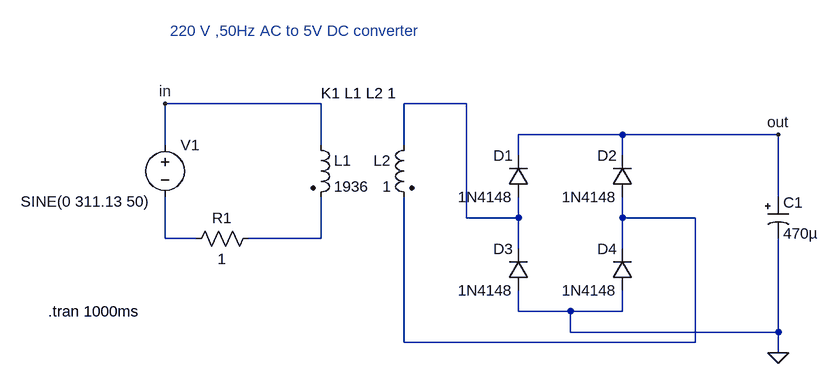
[diagram p0: schematic ACDCConvertor.asc]
ACDCConvertor.asc, the LTspice schematic file:
Version 4
SHEET 1 880 680
WIRE -160 0 -400 0
WIRE 64 0 -32 0
WIRE 304 48 144 48
WIRE 544 48 304 48
WIRE -400 64 -400 0
WIRE -160 64 -160 0
WIRE -32 64 -32 0
WIRE 144 80 144 48
WIRE 304 80 304 48
WIRE 544 144 544 48
WIRE 64 176 64 0
WIRE 144 176 144 144
WIRE 144 176 64 176
WIRE 304 176 304 144
WIRE 416 176 304 176
WIRE -400 208 -400 144
WIRE -352 208 -400 208
WIRE -160 208 -160 144
WIRE -160 208 -272 208
WIRE 144 224 144 176
WIRE 304 224 304 176
WIRE 144 320 144 288
WIRE 224 320 144 320
WIRE 304 320 304 288
WIRE 304 320 224 320
WIRE 224 352 224 320
WIRE 544 352 544 208
WIRE 544 352 224 352
WIRE -32 368 -32 144
WIRE 416 368 416 176
WIRE 416 368 -32 368
WIRE 544 384 544 352
FLAG 544 48 out
FLAG -400 0 in
FLAG 544 384 0
SYMBOL diode 160 144 R180
WINDOW 0 24 64 Left 2
WINDOW 3 24 0 Left 2
SYMATTR InstName D1
SYMATTR Value 1N4148
SYMBOL diode 320 144 R180
WINDOW 0 24 64 Left 2
WINDOW 3 24 0 Left 2
SYMATTR InstName D2
SYMATTR Value 1N4148
SYMBOL diode 160 288 R180
WINDOW 0 24 64 Left 2
WINDOW 3 24 0 Left 2
SYMATTR InstName D3
SYMATTR Value 1N4148
SYMBOL diode 320 288 R180
WINDOW 0 24 64 Left 2
WINDOW 3 24 0 Left 2
SYMATTR InstName D4
SYMATTR Value 1N4148
SYMBOL voltage -400 48 R0
WINDOW 3 -122 118 Bottom 2
WINDOW 123 0 0 Left 0
WINDOW 39 0 0 Left 0
SYMATTR InstName V1
SYMATTR Value SINE(0 311.13 50)
SYMBOL ind2 -176 48 R0
SYMATTR InstName L1
SYMATTR Value 1936
SYMATTR Type ind
SYMBOL ind2 -16 48 M0
SYMATTR InstName L2
SYMATTR Value 1
SYMATTR Type ind
SYMBOL polcap 528 144 R0
SYMATTR InstName C1
SYMATTR Value 470µ
SYMBOL res -256 192 R90
WINDOW 0 0 56 VBottom 2
WINDOW 3 32 56 VTop 2
SYMATTR InstName R1
SYMATTR Value 1
TEXT -160 -16 Left 2 !K1 L1 L2 1
TEXT -580 320 Left 2 !.tran 1000ms
TEXT -392 -112 Left 2 ;220 V ,50Hz AC to 5V DC converter

The netlist it stands for:
* ACDCConvertor.asc
D1 N001 out 1N4148
D2 N002 out 1N4148
D3 0 N001 1N4148
D4 0 N002 1N4148
V1 in N003 SINE(0 311.13 50)
L1 in N004 1936
L2 N001 N002 1
C1 out 0 470µ
R1 N004 N003 1
.model D D
.lib standard.dio
K1 L1 L2 1
.tran 1000ms
* 220 V ,50Hz AC to 5V DC converter
.backanno
.end